# Altium project STM32C8T6Basic.PrjPcb
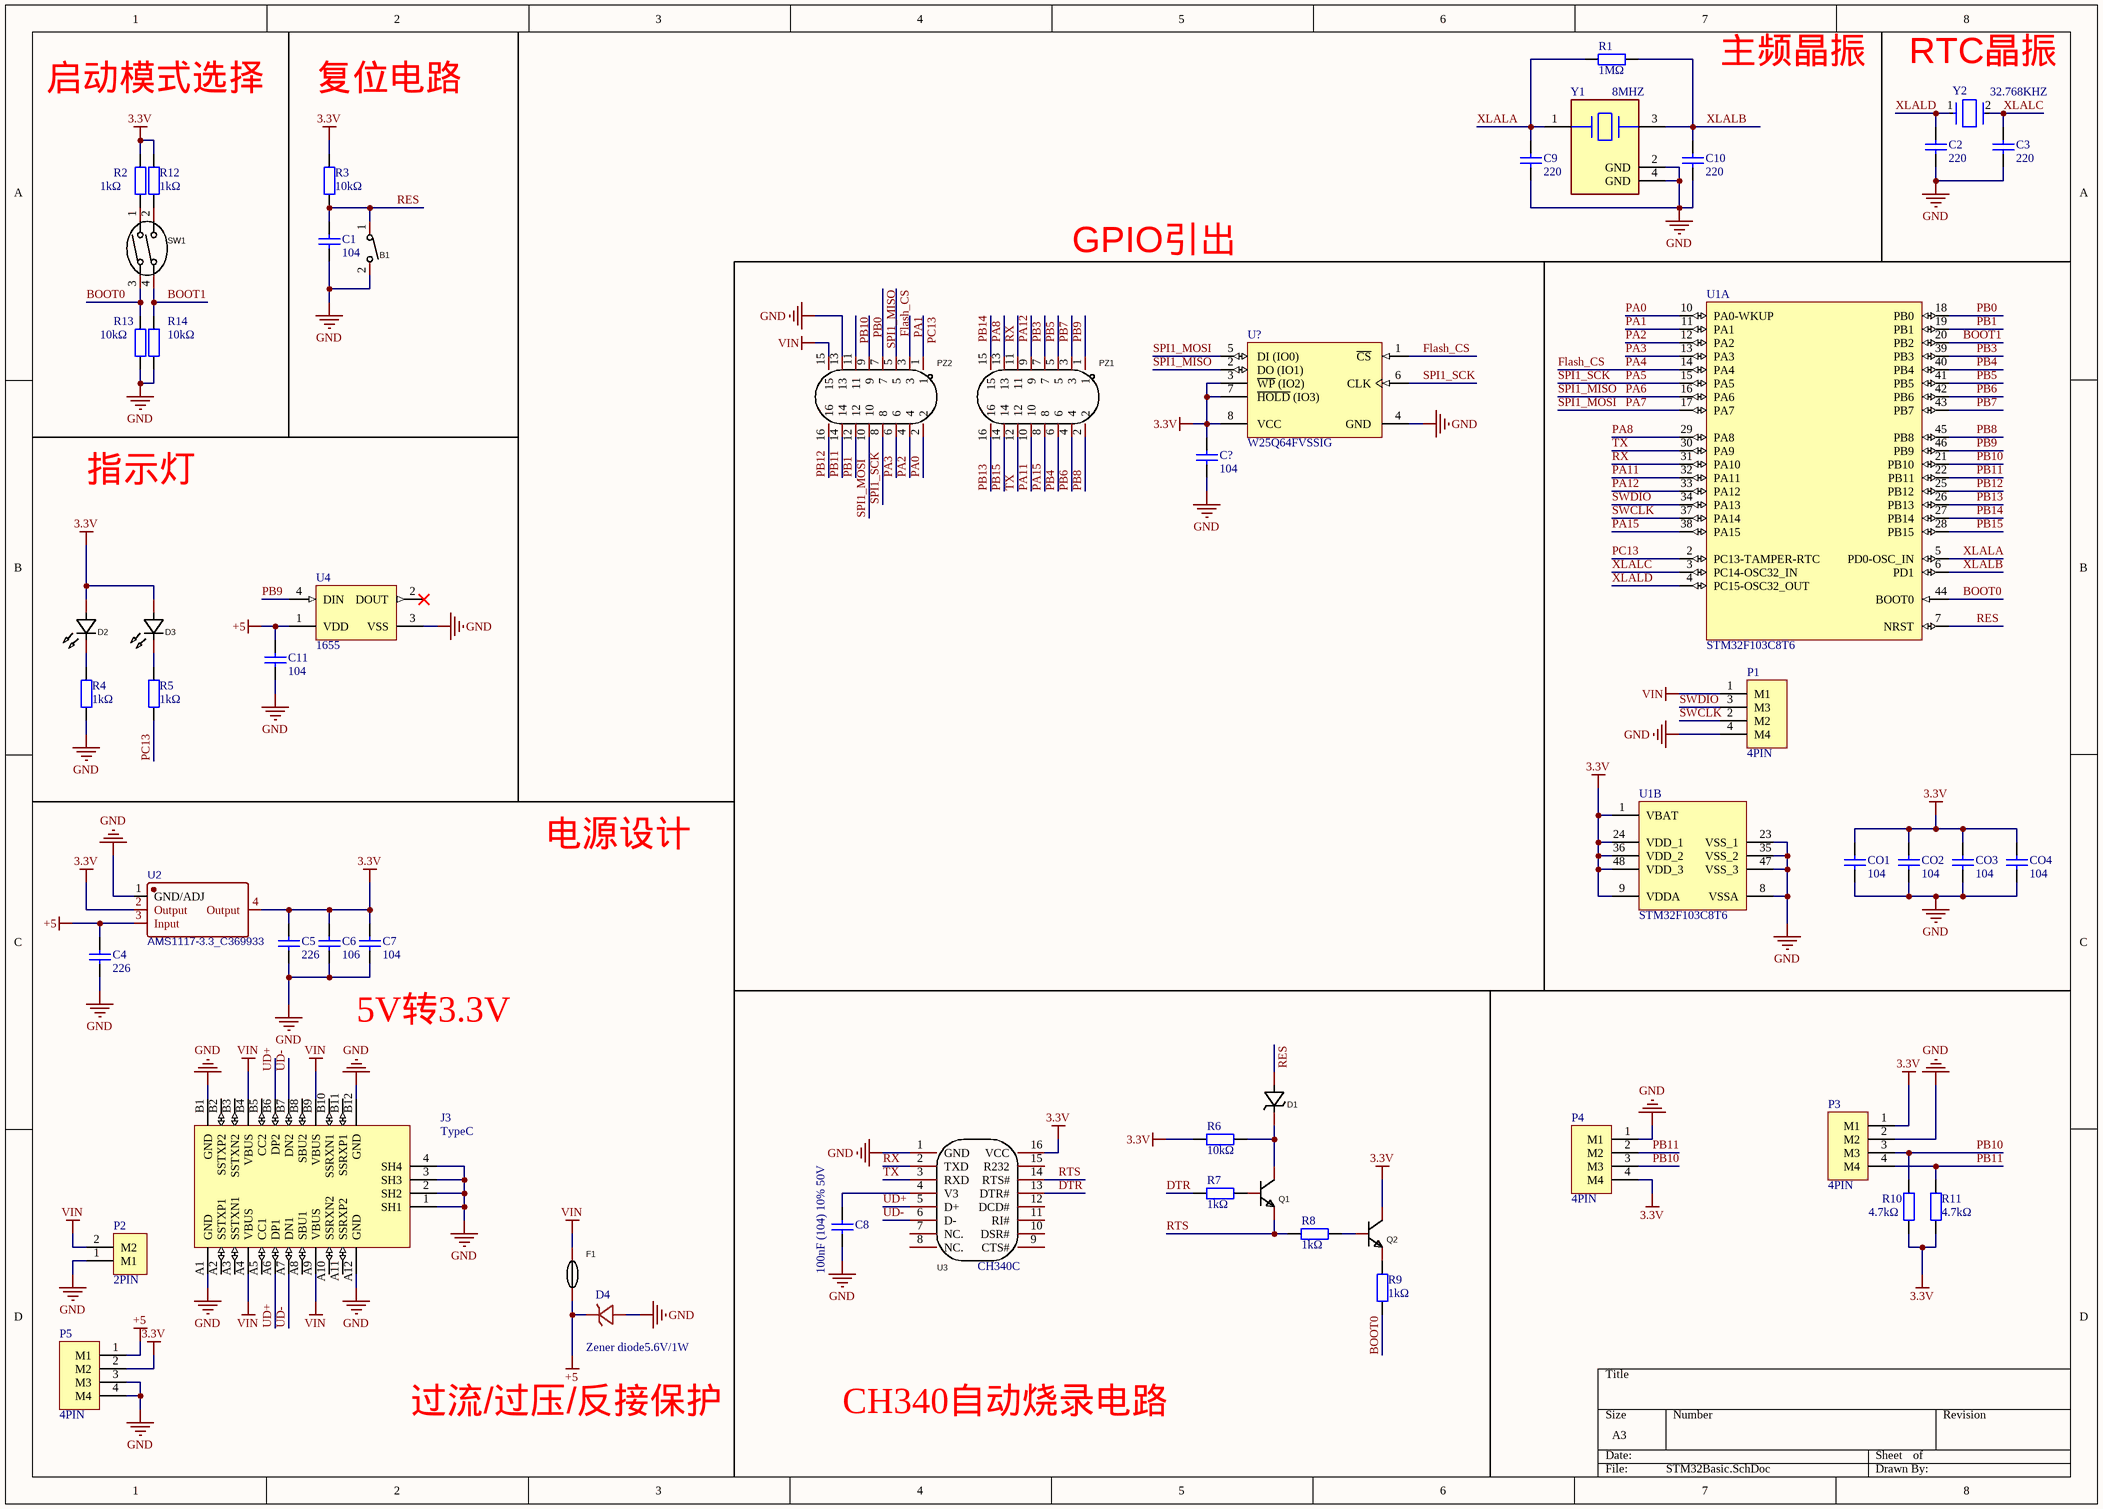
[diagram p0: STM32Basic.SchDoc]
1 sheet, 54 parts. Net scope: global (net labels, ports and power ports of the same name join across sheets).
Board file: STM32Basic.PcbDoc

## Sheet STM32Basic.SchDoc
size A3; SheetNumber: 1; SheetTotal: 1

### Parts
B1  TS342A2P-WZ  [SW-SMD_L4.0-W2.9-LS5.0]  (value not drawn)
C1  104  [0603_C]
C2  220  [0603_C]
C3  220  [0603_C]
C4  226  [0603_C]
C5  226  [0603_C]
C6  106  [0603_C]
C7  104  [0603_C]
C8  100nF (104) 10% 50V  [0603_C]
C9  220  [0603_C]
C10  220  [0603_C]
C11  104  [0603_C]
C?  104  [0603_C]
CO1  104  [0603_C]
CO2  104  [0603_C]
CO3  104  [0603_C]
CO4  104  [0603_C]
D1  BZT52C5V1S  [SOD-323_L1.8-W1.3-LS2.5-RD]  (value not drawn)
D2  RF-BGB170TS-CB-E0  [LED0805-RD_BLUE]  (value not drawn)
D3  RF-BGB170TS-CB-E0  [LED0805-RD_BLUE]  (value not drawn)
D4  Zener diode5.6V/1W  [DIOMELF5025N]
F1  Fuse0805-1A  [F0805]  (value not drawn)
J3  TypeC  [TYPE-C 16P]
P1  4PIN  [XH4/2.54mm/90]
P2  2PIN  [MX1.25WS-2P]
P3  4PIN  [OLED12864]
P4  4PIN  [PH2.0WS-4P]
P5  4PIN  [Header 4]
PZ1  PH-00039  [HDR-TH_16P-P2.54-V-M-R2-C8-S2.54]  (value not drawn)
PZ2  PH-00039  [HDR-TH_16P-P2.54-V-M-R2-C8-S2.54]  (value not drawn)
Q1  SS8050  [SOT-23-3_L2.9-W1.3-P1.90-LS2.4-BR]  (value not drawn)
Q2  SS8050  [SOT-23-3_L2.9-W1.3-P1.90-LS2.4-BR]  (value not drawn)
R1  1MΩ  [0201_R]
R2  1kΩ  [0603_R]
R3  10kΩ  [0603_R]
R4  1kΩ  [0603_R]
R5  1kΩ  [0603_R]
R6  10kΩ  [0603_R]
R7  1kΩ  [0603_R]
R8  1kΩ  [0603_R]
R9  1kΩ  [0603_R]
R10  4.7kΩ  [0201_R]
R11  4.7kΩ  [0201_R]
R12  1kΩ  [0603_R]
R13  10kΩ  [0603_R]
R14  10kΩ  [0603_R]
SW1  拨码开关,平拨开关,DSWB02LHGET  [SW-TH_DSWB02LHGET]  (value not drawn)
U1  STM32F103C8T6  [LQFP-48_L7.0-W7.0-P0.50-LS9.0-BL]  (parts A,B of 2)
U2  AMS1117-3.3_C369933  [SOT-223-4_L6.5-W3.5-P2.30-LS7.0-BR]
U3  CH340C  [SOP-16_L10.0-W3.9-P1.27-LS6.0-BL]
U4  1655  [ADA-RGB-1655_V]
U?  W25Q64FVSSIG  [WINB-SOIC-8_M]
Y1  8MHZ  [FP-ABM3B-MFG]
Y2  32.768KHZ  [FP-ABS06-MFG]

### Nets
3.3V: C5.2 C6.2 C7.2 C?.2 CO1.2 CO2.2 CO3.2 CO4.2 D2.2(A) D3.2(A) P3.1(M1) P4.4(M4) P5.2(M2) Q2.3(C) R2.2 R3.2 R6.1 R10.1 R11.1 R12.2 U1.1(VBAT) U1.9(VDDA) U1.24(VDD_1) U1.36(VDD_2) U1.48(VDD_3) U2.2(Output) U2.4(Output) U3.16(VCC) U?.3(~{WP}_(IO2)) U?.7(~{HOLD}_(IO3)) U?.8(VCC)
+5: C4.2 C11.2 D4.1(C) F1.1 P5.1(M1) U2.3(Input) U4.1(VDD)
GND: B1.2 C1.1 C2.1 C3.1 C4.1 C5.1 C6.1 C7.1 C8.1 C9.1 C10.1 C11.1 C?.1 CO1.1 CO2.1 CO3.1 CO4.1 D4.2(A) J3.1(SH1) J3.2(SH2) J3.3(SH3) J3.4(SH4) J3.A1(GND) J3.A12(GND) J3.B1(GND) J3.B12(GND) P1.4(M4) P2.1(M1) P3.2(M2) P4.1(M1) P5.3(M3) P5.4(M4) PZ2.13 R4.1 R13.1 R14.1 U1.8(VSSA) U1.23(VSS_1) U1.35(VSS_2) U1.47(VSS_3) U2.1(GND/ADJ) U3.1(GND) U4.3(VSS) U?.4(GND) Y1.2(GND) Y1.4(GND)
VIN: F1.2 J3.A4(VBUS) J3.A9(VBUS) J3.B4(VBUS) J3.B9(VBUS) P1.1(M1) P2.2(M2) PZ2.15
BOOT0: R9.1 R13.2 SW1.3 U1.44(BOOT0)
BOOT1: R14.2 SW1.4 U1.20(PB2)
DTR: R7.1 U3.13(DTR#)
Flash_CS: PZ2.5 U1.14(PA4) U?.1(~{CS})  [also labelled PA4]
PA0: PZ2.2 U1.10(PA0-WKUP)
PA1: PZ2.3 U1.11(PA1)
PA2: PZ2.4 U1.12(PA2)
PA3: PZ2.6 U1.13(PA3)
PA5: PZ2.8 U1.15(PA5) U?.6(CLK)  [also labelled SPI1_SCK]
PA6: PZ2.7 U1.16(PA6) U?.2(DO_(IO1))  [also labelled SPI1_MISO]
PA7: PZ2.10 U1.17(PA7) U?.5(DI_(IO0))  [also labelled SPI1_MOSI]
PA8: PZ1.13 U1.29(PA8)
PA11: PZ1.10 U1.32(PA11)
PA12: PZ1.9 U1.33(PA12)
PA15: PZ1.8 U1.38(PA15)
PB0: PZ2.9 U1.18(PB0)
PB1: PZ2.12 U1.19(PB1)
PB3: PZ1.7 U1.39(PB3)
PB4: PZ1.6 U1.40(PB4)
PB5: PZ1.5 U1.41(PB5)
PB6: PZ1.4 U1.42(PB6)
PB7: PZ1.3 U1.43(PB7)
PB8: PZ1.2 U1.45(PB8)
PB9: PZ1.1 U1.46(PB9) U4.4(DIN)
PB10: P3.3(M3) P4.3(M3) PZ2.11 R10.2 U1.21(PB10)
PB11: P3.4(M4) P4.2(M2) PZ2.14 R11.2 U1.22(PB11)
PB12: PZ2.16 U1.25(PB12)
PB13: PZ1.16 U1.26(PB13)
PB14: PZ1.15 U1.27(PB14)
PB15: PZ1.14 U1.28(PB15)
PC13: PZ2.1 R5.1 U1.2(PC13-TAMPER-RTC)
RES: B1.1 C1.2 D1.2(A) R3.1 U1.7(NRST)
RTS: Q1.2(E) R8.1 U3.14(RTS#)
RX: PZ1.11 U1.31(PA10) U3.2(TXD)
SWCLK: P1.2(M2) U1.37(PA14)
SWDIO: P1.3(M3) U1.34(PA13)
TX: PZ1.12 U1.30(PA9) U3.3(RXD)
UD+: J3.A6(DP1) J3.B6(DP2) U3.5(D+)
UD-: J3.A7(DN1) J3.B7(DN2) U3.6(D-)
XLALA: C9.2 R1.1 U1.5(PD0-OSC_IN) Y1.1
XLALB: C10.2 R1.2 U1.6(PD1) Y1.3
XLALC: C3.2 U1.3(PC14-OSC32_IN) Y2.2
XLALD: C2.2 U1.4(PC15-OSC32_OUT) Y2.1
NetC8_2: C8.2 U3.4(V3)
NetD1_1: D1.1(C) Q1.3(C) R6.2
NetD2_1: D2.1(K) R4.2
NetD3_1: D3.1(K) R5.2
NetQ1_1: Q1.1(B) R7.2
NetQ2_1: Q2.1(B) R8.2
NetQ2_2: Q2.2(E) R9.2
NetR2_1: R2.1 SW1.1
NetR12_1: R12.1 SW1.2

Not connected (* = marked no-connect by the designer): J3 A2(SSTXP1) A3(SSTXN1) A5(CC1) A8(SBU1) A10(SSRXN2) A11(SSRXP2) B2(SSTXP2) B3(SSTXN2) B5(CC2) B8(SBU2) B10(SSRXN1) B11(SSRXP1); U3 7(NC.) 8(NC.) 9(CTS#) 10(DSR#) 11(RI#) 12(DCD#) 15(R232); U4 2(DOUT)*

### Notes on the sheet
- 启动模式选择
- 复位电路
- 主频晶振
- (near Y2) RTC晶振
- GPIO引出
- 指示灯
- 电源设计
- 5V转3.3V
- 过流/过压/反接保护
- CH340自动烧录电路

### Library data of the parts
B1 = TS342A2P-WZ: Manufacturer: SHOU HAN(首韩); Add into BOM: yes; Symbol: TS342A2P-WZ; Device: TS342A2P-WZ; LCSC Part Name: 轻触开关 3*4*2 两脚小龟不带柱 250gf 黑色塑胶按钮; Supplier Part: C557591; Manufacturer Part: TS342A2P-WZ; Supplier Footprint: SMD; JLCPCB Part Class: Extended Part; Datasheet: https://atta.szlcsc.com/upload/public/pdf/source/20200519/C557591_B3A5A21584733303F06306F18577DA8B.pdf; Supplier: LCSC; Convert to PCB: yes
C1-C7 C9-C11 C? CO1-CO4 = SMT_Cap: 贴片电容; ComponentLink1Description: 供应商链接; ComponentLink1URL: http://www.szlcsc.com/product/details_29010.html; Package: 0805; Supplier: LC; SuppliersPartNumber: C28260
C8 = 0603 100nF (104) 10% 50V: 贴片电容; ComponentLink1Description: 供应商链接; ComponentLink1URL: http://www.szlcsc.com/product/details_15331.html; Package: 0603; Supplier: LC; SuppliersPartNumber: C14663
D1 = BZT52C5V1S: Manufacturer: YANGJIE(扬杰); Symbol: BZT52C5V1S_C699201; Add into BOM: yes; Zener Voltage (Nom): 5.1V; Power Dissipation: 200mW; Reverse Leakage Current (Ir): 2μA@2V; Device: BZT52C5V1S; LCSC Part Name: 5.1V 200mW; Supplier Part: C699201; Manufacturer Part: BZT52C5V1S; Supplier Footprint: SOD-323; JLCPCB Part Class: Extended Part; Datasheet: https://atta.szlcsc.com/upload/public/pdf/source/20200713/C699132_346E4D263321C480FD1FEE84DCDF3497.pdf; Supplier: LCSC; Convert to PCB: yes; Tolerance: -
D2 D3 = RF-BGB170TS-CB-E0: Manufacturer: Refond(瑞丰); Add into BOM: yes; Emitted Color: 蓝灯; Forward Current: 20mA; Power Dissipation: 70mW; Viewing Angle: 140°; Mounting Sytle: 正贴; Symbol: RF-BGB170TS-CB-E0; Device: RF-BGB170TS-CB-E0; LCSC Part Name: 蓝灯 正贴; Supplier Part: C2908306; Manufacturer Part: RF-BGB170TS-CB-E0; Supplier Footprint: 0805; JLCPCB Part Class: Extended Part; Datasheet: https://atta.szlcsc.com/upload/public/pdf/source/20211101/C871A18E9B6E101B84BDF0C661245F86.pdf; Supplier: LCSC; Convert to PCB: yes; Diode Configuration: -; Lens Color: -; Dominant Wavelength: -; Peak Wavelength: -; Color Temperature: -; Luminous Flux (@25℃): -; Forward Voltage (VF): -; Luminous Intensity: -; Operating Temperature: -40℃~+85℃
D4 = ZM4734
F1 = SMD0805-110: Manufacturer: DOWO(东沃); Symbol: SMD0805-110_C883453; Add into BOM: yes; Operating Voltage (Max): 6V; Current Rating (Max): 100A; Hold Current: 1.1A; Trip Current: 2.2A; Power Dissipation: 600mW; Resistance - Initial (Ri) (Min): 60mΩ; Resistance - Post Trip (R1) (Max): 210mΩ; Maximum Time to Trip: 0.3s; Device: SMD0805-110; LCSC Part Name: SMD0805-110; Supplier Part: C883453; Manufacturer Part: SMD0805-110; Supplier Footprint: 0805; JLCPCB Part Class: Extended Part; Datasheet: https://atta.szlcsc.com/upload/public/pdf/source/20201106/C883453_C41FA8401A960BEA648423C0D5CB40C3.pdf; Supplier: LCSC; Convert to PCB: yes; Operating Temperature: -40℃~+85℃
P1 P3-P5 = 接线端子-4PIN
P2 = 接线端子-2PIN
PZ1 PZ2 = PH-00039: Manufacturer: Liansheng(连盛); Add into BOM: yes; System: Connector; Symbol: PH-00039; Device: PH-00039; LCSC Part Name: 2x8P 2.54mm; Supplier Part: C2830009; Manufacturer Part: PH-00039; Supplier Footprint: 直插,P=2.54mm; JLCPCB Part Class: Extended Part; Datasheet: https://atta.szlcsc.com/upload/public/pdf/source/20220406/F1DB147D91851C087208A2A75059C1DC.pdf; Supplier: LCSC; Convert to PCB: yes
Q1 Q2 = SS8050: Manufacturer: YFW佑风微; Symbol: SS8050_C2898656; Add into BOM: yes; Transistor Type: NPN; Collector-Emitter Breakdown Voltage (Vceo): 25V; Collector Current (Ic): 1.5A; Power Dissipation (Pd): 300mW; Collector-Emitter Saturation Voltage (VCE(sat)@Ic,Ib): 500mV@800mA,80mA; DC Current Gain (hFE@Ic,Vce): 200@100mA,1V; Transition Frequency (fT): 100MHz; Device: SS8050; LCSC Part Name: NPN 25V 1.5A; Supplier Part: C2898656; Manufacturer Part: SS8050; Supplier Footprint: SOT-23; JLCPCB Part Class: Extended Part; Datasheet: https://atta.szlcsc.com/upload/public/pdf/source/20211008/622629BC07A9A4119D4C274AF7AE621D.pdf; Supplier: LCSC; Convert to PCB: yes; Operating Temperature: +150℃@(Tj)
R1-R14 = SMT_Res: 贴片电阻; ComponentLink1Description: 供应商链接; ComponentLink1URL: http://www.szlcsc.com/product/details_23980.html; Package: 0603; Supplier: LC; SuppliersPartNumber: C23253
SW1 = 拨码开关,平拨开关,DSWB02LHGET: Manufacturer: YE; Add into BOM: yes; Circuit: 单刀单掷; Number of Positions: 2; Symbol: DSWB02LHGET; Device: 拨码开关,平拨开关,DSWB02LHGET; LCSC Part Name: 拨码开关,平拨开关,DSWB02LHGET; Supplier Part: C99421; Manufacturer Part: 拨码开关,平拨开关,DSWB02LHGET; Supplier Footprint: DIP; JLCPCB Part Class: Extended Part; Datasheet: https://atta.szlcsc.com/upload/public/pdf/source/20170330/1490854270511.pdf; Supplier: LCSC; Convert to PCB: yes; Type: 平拨，凸起式; Lead Pitch: 2.54mm; Color: 红色
U1 = STM32F103C8T6: 通用型MCU; ComponentLink1Description: 供应商链接; ComponentLink1URL: http://www.szlcsc.com/product/details_9243.html; Package: LQFP-48_7x7x05P; Supplier: LC; SuppliersPartNumber: C8734
U2 = AMS1117-3.3_C369933: BOM_Manufacturer: KEXIN; Contributor: LCSC; BOM_Supplier: LCSC; BOM_Supplier Part: C369933; BOM_Manufacturer Part: AMS1117-3.3; BOM_JLCPCB Part Class: Extended Part; spicePre: U; spiceSymbolName: AMS1117-3.3_C369933
U3 = CH340C: Manufacturer: WCH(南京沁恒); Add into BOM: yes; Protocol: USB 2.0; Data Rate: 2Mbps; Supply Voltage: 3.3V, 5V; Symbol: CH340C; Device: CH340C; LCSC Part Name: CH340C; Supplier Part: C84681; Manufacturer Part: CH340C; Supplier Footprint: SOP-16_150mil; JLCPCB Part Class: Extended Part; Datasheet: https://atta.szlcsc.com/upload/public/pdf/source/20200819/C84681_ADBED554CE321879DBD6B1D06488689C.pdf; Supplier: LCSC; Convert to PCB: yes; Type: Transceiver; Number of Drivers/Receivers: -
U4 = CMP-2000-05026-1: Intelligent Control LED Integrated Light Source, 3.5 to 5.3 V, -25 to 80 degC, 4-Pin SMD, RoHS, Tape and Reel; Manufacturer: Adafruit-Industries-LLC; Number of LEDs: 10; Configuration: Discrete; Utilized LED: WS2812(5050); Datasheet URL: http://datasheet.octopart.com/ADA1655-Adafruit-Industries-datasheet-32028139.pdf; Series: Neopixel; Interface: -; Package Description: 4-Pin Surface Mount Device, Body 5 x 5 mm; Color: Red,Green,Blue(RGB); Category: Optoelectronics; Controller Type: -; Package Reference: 1655; Manufacturer URL: https://www.adafruit.com/; Mounting Type: SurfaceMount; Datasheet Version: May-13; Size / Dimension: 5.00mmLx5.00mmW; Family: Addressable,Specialty
U? = CMP-2000-05007-1: 3V 64M-Bit Serial Flash Memory with Dual/Quad SPI & QPI, 2.7 to 3.6 V, -40 to 85 degC, 8-Pin SOIC, RoHS, Tape and Reel; Manufacturer: Winbond; Boot Type: Bottom/Top; Word Size: 8b; Cell Type: NOR; Operating Supply Voltage (Min): 2.7V; Operating Supply Voltage (Max): 3.6V; Rad Hardened: No; Density: 67108864Bit; Address Bus: 1b; Supply Current: 40mA; Sync/Async: Synchronous; Number of Words: 8M; Programmable: Yes; Operating Supply Voltage (Typ): 3/3.3V; Access Time (Max): 8.5ns; Interface Type: Serial(SPI); Operating Temperature Classification: Industrial; Datasheet Version: Rev. D, 12/2011; Operating Temp Range: -40Cto85C; Operating Temperature (Max): 85C; Pin Count: 8; Mounting: SurfaceMount; Program/Erase Volt (Typ): 2.7to3.6V; Operating Temperature (Min): -40C; Package Description: 8-Pin Small Outline Integrated Circuit, Body 5.28 x 5.28 mm, Pitch 1.27 mm; Datasheet URL: https://datasheet.ciiva.com/15126/getdatasheetpartid-552937-15126648.pdf; Package Reference: SS-8; Manufacturer URL: http://www.winbond.com/hq/index.html?__locale=en; Package Type: SOIC
Y1 = CMP-2000-05730-2: Crystal 8MHz ±10ppm 10pF SMD-4 5mm x 3.2mm; Series Resistance: 200R; Load Capacitance: 10pF; Max Operating Temperature: 60°C; Frequency: 8MHz; Height - Seated (Max): 0.043inch; Frequency Tolerance: 10ppm; Packaging: Tape and Reel; Lead Free: Lead Free; Case/Package: SMD/SMT; Series: ABM3B; Min Operating Temperature: -10°C; REACH SVHC: No SVHC; Length: 0.197inch; RoHS Compliant: Yes; Depth: 3.2mm; Height: 0.043inch; Number of Pins: 4; Mount: Surface Mount; Frequency Stability: 10ppm; Width: 0.126inch; ESR (Equivalent Series Resistance): 200R
Y2 = CMP-27762-015421-1: Crystal 32.768kHz ±20ppm (Tol) 9pF FUND 90kΩ 2-Pin Mini-CSMD T/R; ESR (Equivalent Series Resistance): 90kR; Max Operating Temperature: 85°C; Frequency Tolerance: 20ppm; Case/Package: CSMD; Termination: SMD/SMT; RoHS Compliant: Yes; Height: 0.6mm; Load Capacitance: 9pF; Packaging: Tape and Reel; Depth: 1.2mm; Tolerance: 20ppm; Frequency: 32.768kHz; Series: ABS06; Width: 1.2mm; Length: 2mm; Number of Pins: 2; Min Operating Temperature: -40°C; Mount: Surface Mount; Lead Free: Lead Free; Package Quantity: 3000